# EAGLE design LEDSubMatrixLowDensityTHT (EAGLE 9.6.2)
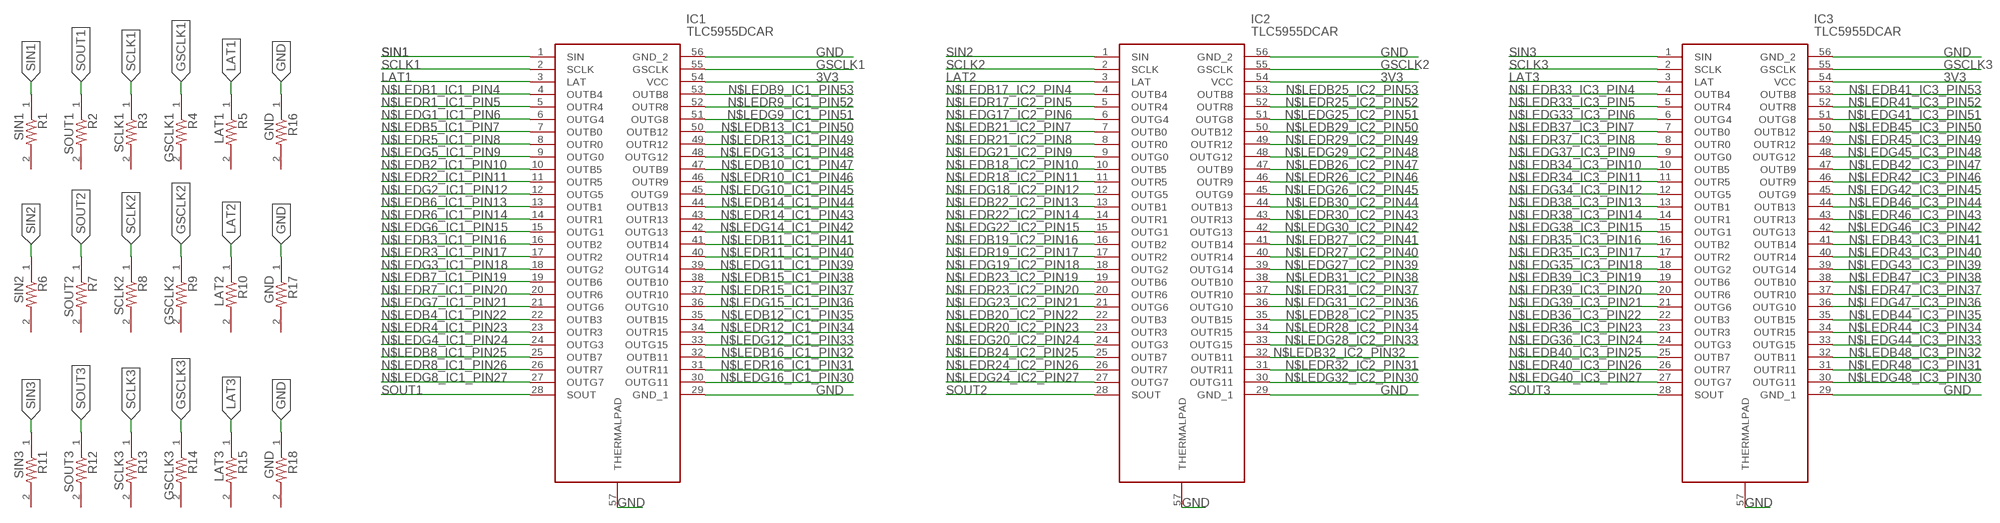
[diagram p0: schematic, sheet 1, part 1 of 2]
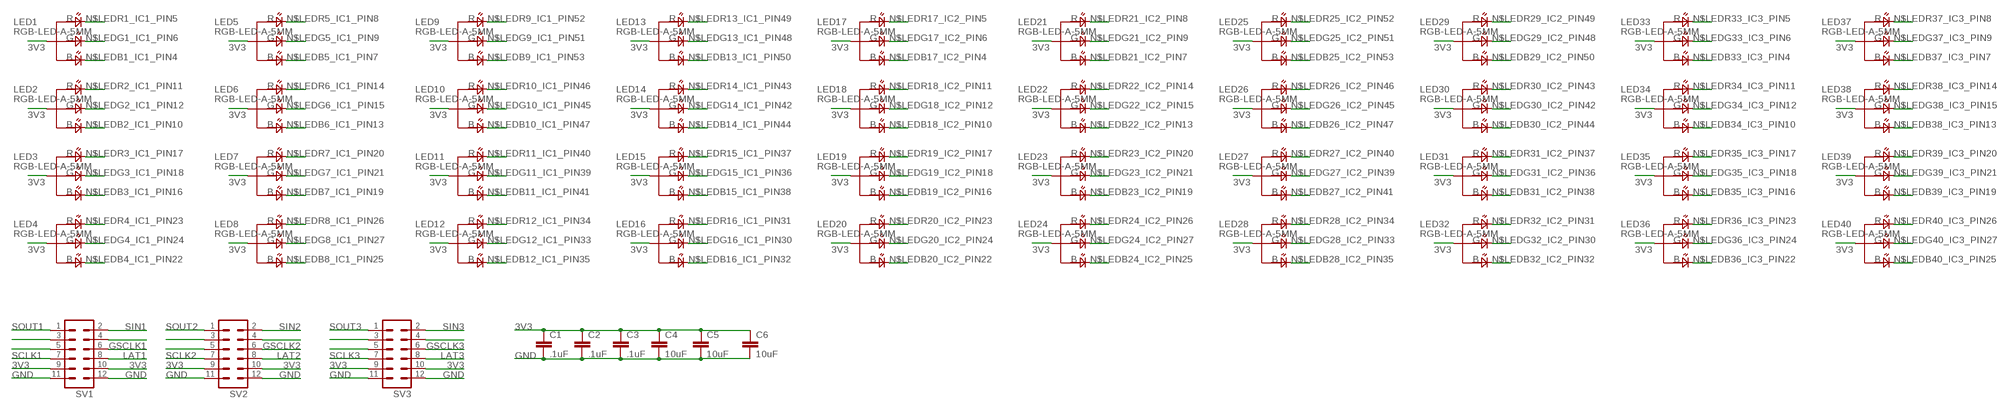
[diagram p1: schematic, sheet 1, part 2 of 2]

## Parts
C1  .1uF  C-EUC0603  [C0603]
C2  .1uF  C-EUC0603  [C0603]
C3  .1uF  C-EUC0603  [C0603]
C4  10uF  C-EUC0805  [C0805]
C5  10uF  C-EUC0805  [C0805]
C6  10uF  C-EUC0805  [C0805]
IC1  TLC5955DCAR  [SOP50P810X120-57N]
IC2  TLC5955DCAR  [SOP50P810X120-57N]
IC3  TLC5955DCAR  [SOP50P810X120-57N]
LED1  RGB-LED-A-5MM  [RGBLED-A-5MM]
LED2  RGB-LED-A-5MM  [RGBLED-A-5MM]
LED3  RGB-LED-A-5MM  [RGBLED-A-5MM]
LED4  RGB-LED-A-5MM  [RGBLED-A-5MM]
LED5  RGB-LED-A-5MM  [RGBLED-A-5MM]
LED6  RGB-LED-A-5MM  [RGBLED-A-5MM]
LED7  RGB-LED-A-5MM  [RGBLED-A-5MM]
LED8  RGB-LED-A-5MM  [RGBLED-A-5MM]
LED9  RGB-LED-A-5MM  [RGBLED-A-5MM]
LED10  RGB-LED-A-5MM  [RGBLED-A-5MM]
LED11  RGB-LED-A-5MM  [RGBLED-A-5MM]
LED12  RGB-LED-A-5MM  [RGBLED-A-5MM]
LED13  RGB-LED-A-5MM  [RGBLED-A-5MM]
LED14  RGB-LED-A-5MM  [RGBLED-A-5MM]
LED15  RGB-LED-A-5MM  [RGBLED-A-5MM]
LED16  RGB-LED-A-5MM  [RGBLED-A-5MM]
LED17  RGB-LED-A-5MM  [RGBLED-A-5MM]
LED18  RGB-LED-A-5MM  [RGBLED-A-5MM]
LED19  RGB-LED-A-5MM  [RGBLED-A-5MM]
LED20  RGB-LED-A-5MM  [RGBLED-A-5MM]
LED21  RGB-LED-A-5MM  [RGBLED-A-5MM]
LED22  RGB-LED-A-5MM  [RGBLED-A-5MM]
LED23  RGB-LED-A-5MM  [RGBLED-A-5MM]
LED24  RGB-LED-A-5MM  [RGBLED-A-5MM]
LED25  RGB-LED-A-5MM  [RGBLED-A-5MM]
LED26  RGB-LED-A-5MM  [RGBLED-A-5MM]
LED27  RGB-LED-A-5MM  [RGBLED-A-5MM]
LED28  RGB-LED-A-5MM  [RGBLED-A-5MM]
LED29  RGB-LED-A-5MM  [RGBLED-A-5MM]
LED30  RGB-LED-A-5MM  [RGBLED-A-5MM]
LED31  RGB-LED-A-5MM  [RGBLED-A-5MM]
LED32  RGB-LED-A-5MM  [RGBLED-A-5MM]
LED33  RGB-LED-A-5MM  [RGBLED-A-5MM]
LED34  RGB-LED-A-5MM  [RGBLED-A-5MM]
LED35  RGB-LED-A-5MM  [RGBLED-A-5MM]
LED36  RGB-LED-A-5MM  [RGBLED-A-5MM]
LED37  RGB-LED-A-5MM  [RGBLED-A-5MM]
LED38  RGB-LED-A-5MM  [RGBLED-A-5MM]
LED39  RGB-LED-A-5MM  [RGBLED-A-5MM]
LED40  RGB-LED-A-5MM  [RGBLED-A-5MM]
R1  SIN1  RCWCTE  [RESC3216X70N]
R2  SOUT1  RCWCTE  [RESC3216X70N]
R3  SCLK1  RCWCTE  [RESC3216X70N]
R4  GSCLK1  RCWCTE  [RESC3216X70N]
R5  LAT1  RCWCTE  [RESC3216X70N]
R6  SIN2  RCWCTE  [RESC3216X70N]
R7  SOUT2  RCWCTE  [RESC3216X70N]
R8  SCLK2  RCWCTE  [RESC3216X70N]
R9  GSCLK2  RCWCTE  [RESC3216X70N]
R10  LAT2  RCWCTE  [RESC3216X70N]
R11  SIN3  RCWCTE  [RESC3216X70N]
R12  SOUT3  RCWCTE  [RESC3216X70N]
R13  SCLK3  RCWCTE  [RESC3216X70N]
R14  GSCLK3  RCWCTE  [RESC3216X70N]
R15  LAT3  RCWCTE  [RESC3216X70N]
R16  GND  RCWCTE  [RESC3216X70N]
R17  GND  RCWCTE  [RESC3216X70N]
R18  GND  RCWCTE  [RESC3216X70N]
SV1  MA06-2  [MA06-2]
SV2  MA06-2  [MA06-2]
SV3  MA06-2  [MA06-2]

## Nets
3V3: C1.1 C2.1 C3.1 C4.1 C5.1 C6.1 IC1.54(VCC) IC2.54(VCC) IC3.54(VCC) LED1.AN(COM) LED2.AN(COM) LED3.AN(COM) LED4.AN(COM) LED5.AN(COM) LED6.AN(COM) LED7.AN(COM) LED8.AN(COM) LED9.AN(COM) LED10.AN(COM) LED11.AN(COM) LED12.AN(COM) LED13.AN(COM) LED14.AN(COM) LED15.AN(COM) LED16.AN(COM) LED17.AN(COM) LED18.AN(COM) LED19.AN(COM) LED20.AN(COM) LED21.AN(COM) LED22.AN(COM) LED23.AN(COM) LED24.AN(COM) LED25.AN(COM) LED26.AN(COM) LED27.AN(COM) LED28.AN(COM) LED29.AN(COM) LED30.AN(COM) LED31.AN(COM) LED32.AN(COM) LED33.AN(COM) LED34.AN(COM) LED35.AN(COM) LED36.AN(COM) LED37.AN(COM) LED38.AN(COM) LED39.AN(COM) LED40.AN(COM) SV1.9 SV1.10 SV2.9 SV2.10 SV3.9 SV3.10
GND: C1.2 C2.2 C3.2 C4.2 C5.2 C6.2 IC1.29(GND_1) IC1.56(GND_2) IC1.57(THERMALPAD) IC2.29(GND_1) IC2.56(GND_2) IC2.57(THERMALPAD) IC3.29(GND_1) IC3.56(GND_2) IC3.57(THERMALPAD) R16.1 R17.1 R18.1 SV1.11 SV1.12 SV2.11 SV2.12 SV3.11 SV3.12
GSCLK1: IC1.55(GSCLK) R4.1 SV1.6
GSCLK2: IC2.55(GSCLK) R9.1 SV2.6
GSCLK3: IC3.55(GSCLK) R14.1 SV3.6
LAT1: IC1.3(LAT) R5.1 SV1.8
LAT2: IC2.3(LAT) R10.1 SV2.8
LAT3: IC3.3(LAT) R15.1 SV3.8
N$2: SV1.3
N$3: SV1.5
N$5: SV1.4
N$7: SV2.3
N$8: SV2.5
N$10: SV2.4
N$12: SV3.3
N$13: SV3.5
N$15: SV3.4
N$LEDB1_IC1_PIN4: IC1.4(OUTB4) LED1.B(BLUE)
N$LEDB2_IC1_PIN10: IC1.10(OUTB5) LED2.B(BLUE)
N$LEDB3_IC1_PIN16: IC1.16(OUTB2) LED3.B(BLUE)
N$LEDB4_IC1_PIN22: IC1.22(OUTB3) LED4.B(BLUE)
N$LEDB5_IC1_PIN7: IC1.7(OUTB0) LED5.B(BLUE)
N$LEDB6_IC1_PIN13: IC1.13(OUTB1) LED6.B(BLUE)
N$LEDB7_IC1_PIN19: IC1.19(OUTB6) LED7.B(BLUE)
N$LEDB8_IC1_PIN25: IC1.25(OUTB7) LED8.B(BLUE)
N$LEDB9_IC1_PIN53: IC1.53(OUTB8) LED9.B(BLUE)
N$LEDB10_IC1_PIN47: IC1.47(OUTB9) LED10.B(BLUE)
N$LEDB11_IC1_PIN41: IC1.41(OUTB14) LED11.B(BLUE)
N$LEDB12_IC1_PIN35: IC1.35(OUTB15) LED12.B(BLUE)
N$LEDB13_IC1_PIN50: IC1.50(OUTB12) LED13.B(BLUE)
N$LEDB14_IC1_PIN44: IC1.44(OUTB13) LED14.B(BLUE)
N$LEDB15_IC1_PIN38: IC1.38(OUTB10) LED15.B(BLUE)
N$LEDB16_IC1_PIN32: IC1.32(OUTB11) LED16.B(BLUE)
N$LEDB17_IC2_PIN4: IC2.4(OUTB4) LED17.B(BLUE)
N$LEDB18_IC2_PIN10: IC2.10(OUTB5) LED18.B(BLUE)
N$LEDB19_IC2_PIN16: IC2.16(OUTB2) LED19.B(BLUE)
N$LEDB20_IC2_PIN22: IC2.22(OUTB3) LED20.B(BLUE)
N$LEDB21_IC2_PIN7: IC2.7(OUTB0) LED21.B(BLUE)
N$LEDB22_IC2_PIN13: IC2.13(OUTB1) LED22.B(BLUE)
N$LEDB23_IC2_PIN19: IC2.19(OUTB6) LED23.B(BLUE)
N$LEDB24_IC2_PIN25: IC2.25(OUTB7) LED24.B(BLUE)
N$LEDB25_IC2_PIN53: IC2.53(OUTB8) LED25.B(BLUE)
N$LEDB26_IC2_PIN47: IC2.47(OUTB9) LED26.B(BLUE)
N$LEDB27_IC2_PIN41: IC2.41(OUTB14) LED27.B(BLUE)
N$LEDB28_IC2_PIN35: IC2.35(OUTB15) LED28.B(BLUE)
N$LEDB29_IC2_PIN50: IC2.50(OUTB12) LED29.B(BLUE)
N$LEDB30_IC2_PIN44: IC2.44(OUTB13) LED30.B(BLUE)
N$LEDB31_IC2_PIN38: IC2.38(OUTB10) LED31.B(BLUE)
N$LEDB32_IC2_PIN32: IC2.32(OUTB11) LED32.B(BLUE)
N$LEDB33_IC3_PIN4: IC3.4(OUTB4) LED33.B(BLUE)
N$LEDB34_IC3_PIN10: IC3.10(OUTB5) LED34.B(BLUE)
N$LEDB35_IC3_PIN16: IC3.16(OUTB2) LED35.B(BLUE)
N$LEDB36_IC3_PIN22: IC3.22(OUTB3) LED36.B(BLUE)
N$LEDB37_IC3_PIN7: IC3.7(OUTB0) LED37.B(BLUE)
N$LEDB38_IC3_PIN13: IC3.13(OUTB1) LED38.B(BLUE)
N$LEDB39_IC3_PIN19: IC3.19(OUTB6) LED39.B(BLUE)
N$LEDB40_IC3_PIN25: IC3.25(OUTB7) LED40.B(BLUE)
N$LEDB41_IC3_PIN53: IC3.53(OUTB8)
N$LEDB42_IC3_PIN47: IC3.47(OUTB9)
N$LEDB43_IC3_PIN41: IC3.41(OUTB14)
N$LEDB44_IC3_PIN35: IC3.35(OUTB15)
N$LEDB45_IC3_PIN50: IC3.50(OUTB12)
N$LEDB46_IC3_PIN44: IC3.44(OUTB13)
N$LEDB47_IC3_PIN38: IC3.38(OUTB10)
N$LEDB48_IC3_PIN32: IC3.32(OUTB11)
N$LEDG1_IC1_PIN6: IC1.6(OUTG4) LED1.G(GREEN)
N$LEDG2_IC1_PIN12: IC1.12(OUTG5) LED2.G(GREEN)
N$LEDG3_IC1_PIN18: IC1.18(OUTG2) LED3.G(GREEN)
N$LEDG4_IC1_PIN24: IC1.24(OUTG3) LED4.G(GREEN)
N$LEDG5_IC1_PIN9: IC1.9(OUTG0) LED5.G(GREEN)
N$LEDG6_IC1_PIN15: IC1.15(OUTG1) LED6.G(GREEN)
N$LEDG7_IC1_PIN21: IC1.21(OUTG6) LED7.G(GREEN)
N$LEDG8_IC1_PIN27: IC1.27(OUTG7) LED8.G(GREEN)
N$LEDG9_IC1_PIN51: IC1.51(OUTG8) LED9.G(GREEN)
N$LEDG10_IC1_PIN45: IC1.45(OUTG9) LED10.G(GREEN)
N$LEDG11_IC1_PIN39: IC1.39(OUTG14) LED11.G(GREEN)
N$LEDG12_IC1_PIN33: IC1.33(OUTG15) LED12.G(GREEN)
N$LEDG13_IC1_PIN48: IC1.48(OUTG12) LED13.G(GREEN)
N$LEDG14_IC1_PIN42: IC1.42(OUTG13) LED14.G(GREEN)
N$LEDG15_IC1_PIN36: IC1.36(OUTG10) LED15.G(GREEN)
N$LEDG16_IC1_PIN30: IC1.30(OUTG11) LED16.G(GREEN)
N$LEDG17_IC2_PIN6: IC2.6(OUTG4) LED17.G(GREEN)
N$LEDG18_IC2_PIN12: IC2.12(OUTG5) LED18.G(GREEN)
N$LEDG19_IC2_PIN18: IC2.18(OUTG2) LED19.G(GREEN)
N$LEDG20_IC2_PIN24: IC2.24(OUTG3) LED20.G(GREEN)
N$LEDG21_IC2_PIN9: IC2.9(OUTG0) LED21.G(GREEN)
N$LEDG22_IC2_PIN15: IC2.15(OUTG1) LED22.G(GREEN)
N$LEDG23_IC2_PIN21: IC2.21(OUTG6) LED23.G(GREEN)
N$LEDG24_IC2_PIN27: IC2.27(OUTG7) LED24.G(GREEN)
N$LEDG25_IC2_PIN51: IC2.51(OUTG8) LED25.G(GREEN)
N$LEDG26_IC2_PIN45: IC2.45(OUTG9) LED26.G(GREEN)
N$LEDG27_IC2_PIN39: IC2.39(OUTG14) LED27.G(GREEN)
N$LEDG28_IC2_PIN33: IC2.33(OUTG15) LED28.G(GREEN)
N$LEDG29_IC2_PIN48: IC2.48(OUTG12) LED29.G(GREEN)
N$LEDG30_IC2_PIN42: IC2.42(OUTG13) LED30.G(GREEN)
N$LEDG31_IC2_PIN36: IC2.36(OUTG10) LED31.G(GREEN)
N$LEDG32_IC2_PIN30: IC2.30(OUTG11) LED32.G(GREEN)
N$LEDG33_IC3_PIN6: IC3.6(OUTG4) LED33.G(GREEN)
N$LEDG34_IC3_PIN12: IC3.12(OUTG5) LED34.G(GREEN)
N$LEDG35_IC3_PIN18: IC3.18(OUTG2) LED35.G(GREEN)
N$LEDG36_IC3_PIN24: IC3.24(OUTG3) LED36.G(GREEN)
N$LEDG37_IC3_PIN9: IC3.9(OUTG0) LED37.G(GREEN)
N$LEDG38_IC3_PIN15: IC3.15(OUTG1) LED38.G(GREEN)
N$LEDG39_IC3_PIN21: IC3.21(OUTG6) LED39.G(GREEN)
N$LEDG40_IC3_PIN27: IC3.27(OUTG7) LED40.G(GREEN)
N$LEDG41_IC3_PIN51: IC3.51(OUTG8)
N$LEDG42_IC3_PIN45: IC3.45(OUTG9)
N$LEDG43_IC3_PIN39: IC3.39(OUTG14)
N$LEDG44_IC3_PIN33: IC3.33(OUTG15)
N$LEDG45_IC3_PIN48: IC3.48(OUTG12)
N$LEDG46_IC3_PIN42: IC3.42(OUTG13)
N$LEDG47_IC3_PIN36: IC3.36(OUTG10)
N$LEDG48_IC3_PIN30: IC3.30(OUTG11)
N$LEDR1_IC1_PIN5: IC1.5(OUTR4) LED1.R(RED)
N$LEDR2_IC1_PIN11: IC1.11(OUTR5) LED2.R(RED)
N$LEDR3_IC1_PIN17: IC1.17(OUTR2) LED3.R(RED)
N$LEDR4_IC1_PIN23: IC1.23(OUTR3) LED4.R(RED)
N$LEDR5_IC1_PIN8: IC1.8(OUTR0) LED5.R(RED)
N$LEDR6_IC1_PIN14: IC1.14(OUTR1) LED6.R(RED)
N$LEDR7_IC1_PIN20: IC1.20(OUTR6) LED7.R(RED)
N$LEDR8_IC1_PIN26: IC1.26(OUTR7) LED8.R(RED)
N$LEDR9_IC1_PIN52: IC1.52(OUTR8) LED9.R(RED)
N$LEDR10_IC1_PIN46: IC1.46(OUTR9) LED10.R(RED)
N$LEDR11_IC1_PIN40: IC1.40(OUTR14) LED11.R(RED)
N$LEDR12_IC1_PIN34: IC1.34(OUTR15) LED12.R(RED)
N$LEDR13_IC1_PIN49: IC1.49(OUTR12) LED13.R(RED)
N$LEDR14_IC1_PIN43: IC1.43(OUTR13) LED14.R(RED)
N$LEDR15_IC1_PIN37: IC1.37(OUTR10) LED15.R(RED)
N$LEDR16_IC1_PIN31: IC1.31(OUTR11) LED16.R(RED)
N$LEDR17_IC2_PIN5: IC2.5(OUTR4) LED17.R(RED)
N$LEDR18_IC2_PIN11: IC2.11(OUTR5) LED18.R(RED)
N$LEDR19_IC2_PIN17: IC2.17(OUTR2) LED19.R(RED)
N$LEDR20_IC2_PIN23: IC2.23(OUTR3) LED20.R(RED)
N$LEDR21_IC2_PIN8: IC2.8(OUTR0) LED21.R(RED)
N$LEDR22_IC2_PIN14: IC2.14(OUTR1) LED22.R(RED)
N$LEDR23_IC2_PIN20: IC2.20(OUTR6) LED23.R(RED)
N$LEDR24_IC2_PIN26: IC2.26(OUTR7) LED24.R(RED)
N$LEDR25_IC2_PIN52: IC2.52(OUTR8) LED25.R(RED)
N$LEDR26_IC2_PIN46: IC2.46(OUTR9) LED26.R(RED)
N$LEDR27_IC2_PIN40: IC2.40(OUTR14) LED27.R(RED)
N$LEDR28_IC2_PIN34: IC2.34(OUTR15) LED28.R(RED)
N$LEDR29_IC2_PIN49: IC2.49(OUTR12) LED29.R(RED)
N$LEDR30_IC2_PIN43: IC2.43(OUTR13) LED30.R(RED)
N$LEDR31_IC2_PIN37: IC2.37(OUTR10) LED31.R(RED)
N$LEDR32_IC2_PIN31: IC2.31(OUTR11) LED32.R(RED)
N$LEDR33_IC3_PIN5: IC3.5(OUTR4) LED33.R(RED)
N$LEDR34_IC3_PIN11: IC3.11(OUTR5) LED34.R(RED)
N$LEDR35_IC3_PIN17: IC3.17(OUTR2) LED35.R(RED)
N$LEDR36_IC3_PIN23: IC3.23(OUTR3) LED36.R(RED)
N$LEDR37_IC3_PIN8: IC3.8(OUTR0) LED37.R(RED)
N$LEDR38_IC3_PIN14: IC3.14(OUTR1) LED38.R(RED)
N$LEDR39_IC3_PIN20: IC3.20(OUTR6) LED39.R(RED)
N$LEDR40_IC3_PIN26: IC3.26(OUTR7) LED40.R(RED)
N$LEDR41_IC3_PIN52: IC3.52(OUTR8)
N$LEDR42_IC3_PIN46: IC3.46(OUTR9)
N$LEDR43_IC3_PIN40: IC3.40(OUTR14)
N$LEDR44_IC3_PIN34: IC3.34(OUTR15)
N$LEDR45_IC3_PIN49: IC3.49(OUTR12)
N$LEDR46_IC3_PIN43: IC3.43(OUTR13)
N$LEDR47_IC3_PIN37: IC3.37(OUTR10)
N$LEDR48_IC3_PIN31: IC3.31(OUTR11)
SCLK1: IC1.2(SCLK) R3.1 SV1.7
SCLK2: IC2.2(SCLK) R8.1 SV2.7
SCLK3: IC3.2(SCLK) R13.1 SV3.7
SIN1: IC1.1(SIN) R1.1 SV1.2
SIN2: IC2.1(SIN) R6.1 SV2.2
SIN3: IC3.1(SIN) R11.1 SV3.2
SOUT1: IC1.28(SOUT) R2.1 SV1.1
SOUT2: IC2.28(SOUT) R7.1 SV2.1
SOUT3: IC3.28(SOUT) R12.1 SV3.1
Unconnected: R1.2 R2.2 R3.2 R4.2 R5.2 R6.2 R7.2 R8.2 R9.2 R10.2 R11.2 R12.2 R13.2 R14.2 R15.2 R16.2 R17.2 R18.2

## Library data of the parts
C1-C6 = rcl:C-EU: CAPACITOR, European symbol; SPICEPREFIX: C
IC1-IC3 = TLC5955DCAR:TLC5955DCAR: 48ch, 16bit PWM LED Driver with Dot-Correction, Brightness Control, Open/Short Detection Source: Datasheet <http://www.ti.com/lit/ds/symlink/tlc5955.pdf>; ARROW_PART_NUMBER: TLC5955DCAR; ARROW_PRICE-STOCK: https://www.arrow.com/en/products/tlc5955dcar/texas-instruments; DESCRIPTION: 48ch, 16bit PWM LED Driver with Dot-Correction, Brightness Control, Open/Short Detection; HEIGHT: 1.2mm; MANUFACTURER_NAME: Texas Instruments; MANUFACTURER_PART_NUMBER: TLC5955DCAR; MOUSER_PART_NUMBER: 595-TLC5955DCAR; MOUSER_PRICE-STOCK: https://www.mouser.co.uk/ProductDetail/Texas-Instruments/TLC5955DCAR?qs=%2Fd%252BFzHvH4c3zo%2FeGYG5n7g%3D%3D
LED1-LED40 = VoxelEagleLib:RGB-LED-A-5MM
R1-R18 = RCWCTE:RCWCTE: Res 1206 0 Ohm Metal SMD Automotive Embossed Plastic T/R; DESCRIPTION: - PC Test Point - - Plating Surface Mount Mounting Type; DIGI-KEY_PART_NUMBER: 2019-RCWCTECT-ND; MF: KOA Speer; MP: RCWCTE; PACKAGE: None; PURCHASE-URL: https://pricing.snapeda.com/search/part/RCWCTE/?ref=eda
SV1-SV3 = con-lstb:MA06-2: PIN HEADER; OC_FARNELL: unknown; OC_NEWARK: unknown

## Board
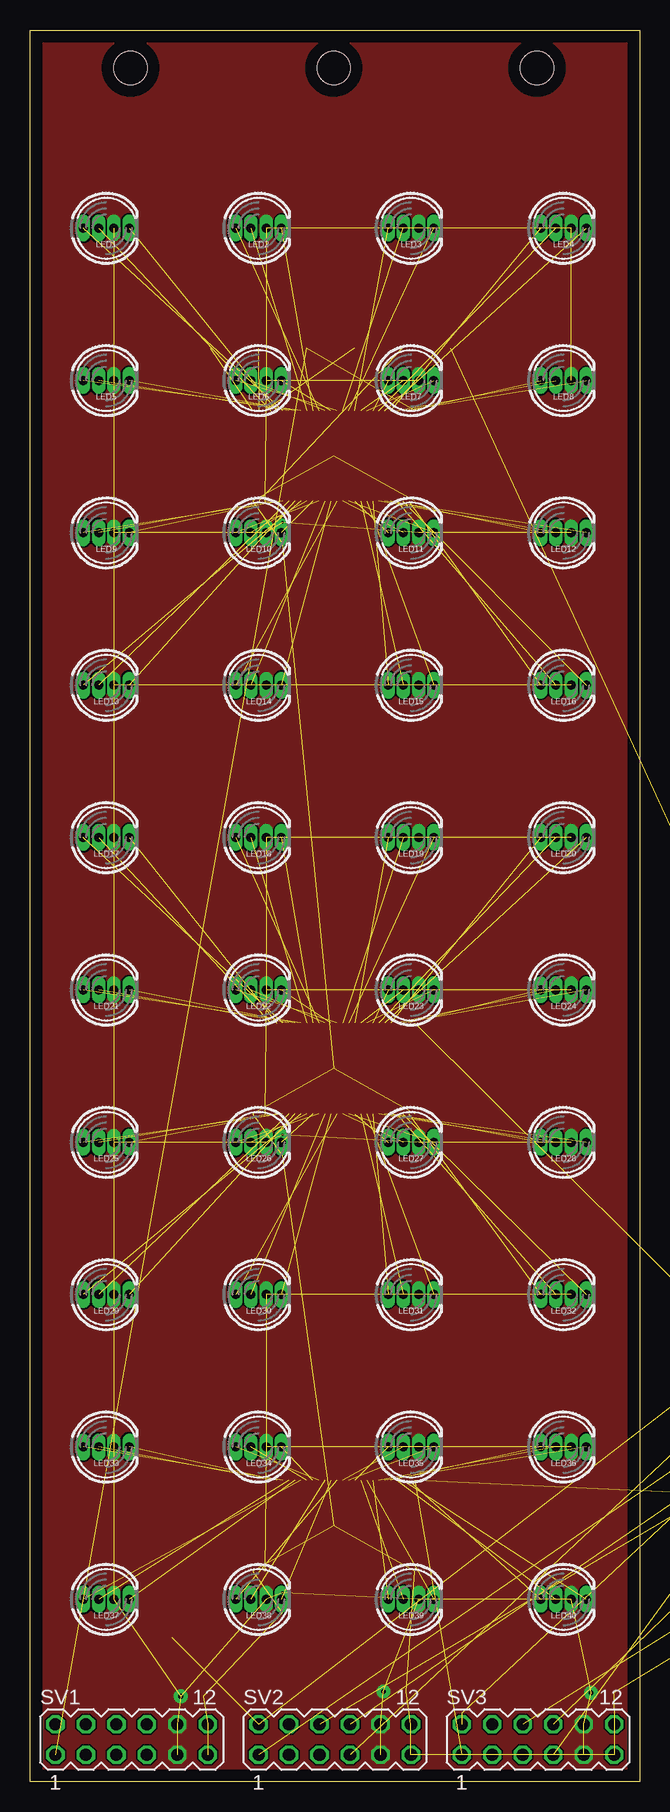
[diagram p2: board, top side]
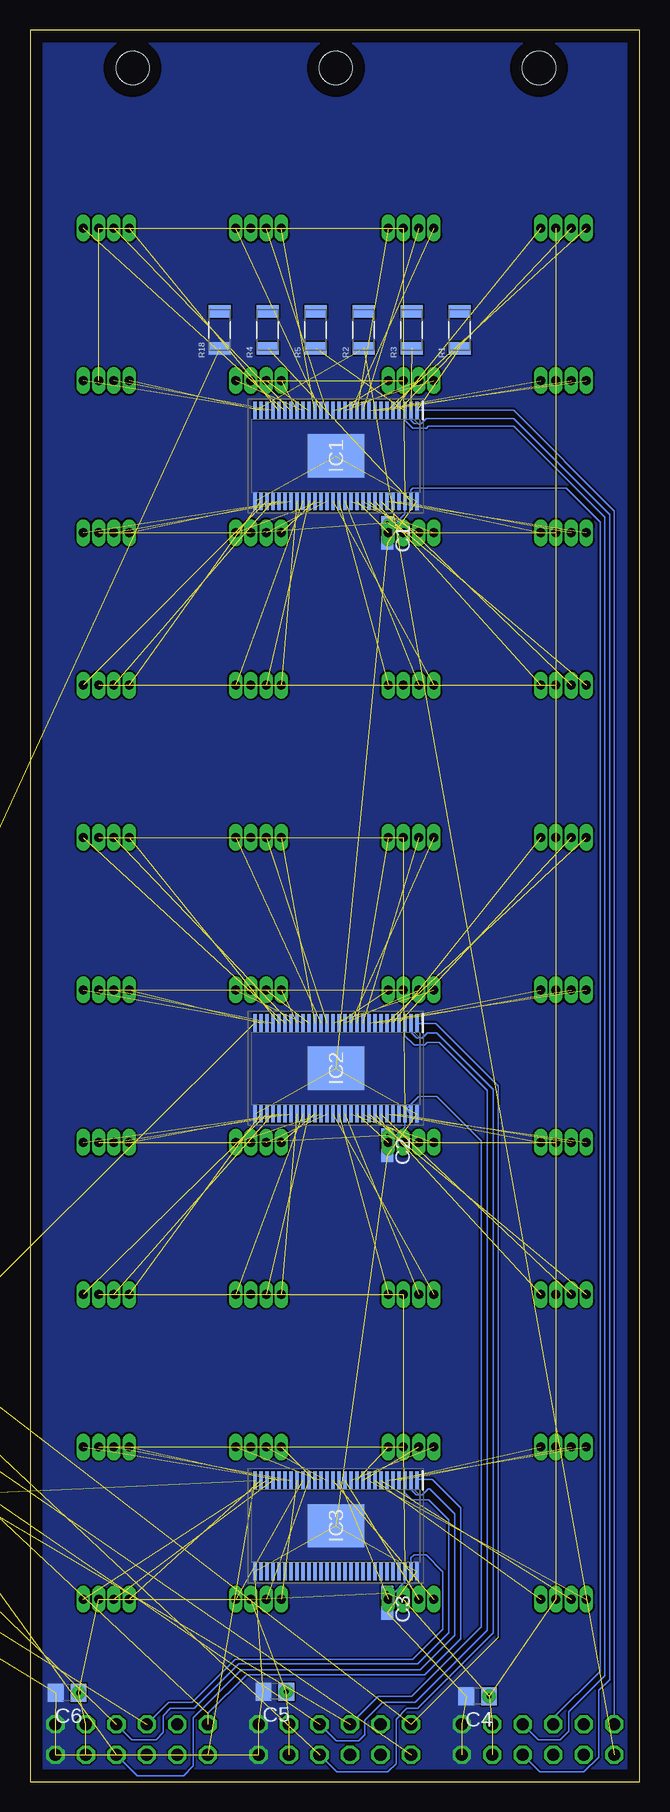
[diagram p3: board, bottom side, seen from below]

Size 50.8 x 146 mm. Coordinates in mm from the lower left corner, seen from the top.
Outline: 0,146 50.8,146 50.8,0 0,0 0,146
Copper layers (1*16): Top 0.035mm / dielectric 1.5mm / Bottom 0.035mm
Design rules "default *": minimum track width 6mil, minimum drill 0.35mm, track to track 6mil, track to pad 6mil, pad to pad 6mil, via to via 6mil, smd to smd 6mil, copper to edge 40mil, drill to drill 6mil, minimum pad ring 0.000253125mm, minimum via ring 8mil, stop-mask expansion 4mil, vias tented up to drill 0mil, thermal gap 10mil
Holes 2.75 mm at 8.38,142.82 25.32,142.82 42.25,142.82

### Footprints (pad centres in the part's own frame; a part is rotated, then mirrored left to right if it is on the bottom)
C0603 = smd 1.1 x 1: 1 -0.85,0; 2 0.85,0
C0805 = smd 1.3 x 1.5: 1 -0.95,0; 2 0.95,0
SOP50P810X120-57N = smd 1.475 x 0.3: 1 -3.788,6.75; 2 -3.788,6.25; 3 -3.788,5.75; 4 -3.788,5.25; 5 -3.788,4.75; 6 -3.788,4.25; 7 -3.788,3.75; 8 -3.788,3.25; 9 -3.788,2.75; 10 -3.788,2.25; 11 -3.788,1.75; 12 -3.788,1.25; 13 -3.788,0.75; 14 -3.788,0.25; 15 -3.788,-0.25; 16 -3.788,-0.75; 17 -3.788,-1.25; 18 -3.788,-1.75; 19 -3.788,-2.25; 20 -3.788,-2.75; 21 -3.788,-3.25; 22 -3.788,-3.75; 23 -3.788,-4.25; 24 -3.788,-4.75; 25 -3.788,-5.25; 26 -3.788,-5.75; 27 -3.788,-6.25; 28 -3.788,-6.75; 29 3.788,-6.75; 30 3.788,-6.25; 31 3.788,-5.75; 32 3.788,-5.25; 33 3.788,-4.75; 34 3.788,-4.25; 35 3.788,-3.75; 36 3.788,-3.25; 37 3.788,-2.75; 38 3.788,-2.25; 39 3.788,-1.75; 40 3.788,-1.25; 41 3.788,-0.75; 42 3.788,-0.25; 43 3.788,0.25; 44 3.788,0.75; 45 3.788,1.25; 46 3.788,1.75; 47 3.788,2.25; 48 3.788,2.75; 49 3.788,3.25; 50 3.788,3.75; 51 3.788,4.25; 52 3.788,4.75; 53 3.788,5.25; 54 3.788,5.75; 55 3.788,6.25; 56 3.788,6.75 | smd 3.61 x 4.7: 57 0,0
RGBLED-A-5MM = drill 0.75 pad 0.813 long: AN 0.635,0; B -0.635,0; G -1.905,0; R 1.905,0
RESC3216X70N = smd 1.04 x 1.82: 1 -1.54,0; 2 1.54,0
MA06-2 = drill 1.016 octagon: 1 -6.35,-1.27; 2 -6.35,1.27; 3 -3.81,-1.27; 4 -3.81,1.27; 5 -1.27,-1.27; 6 -1.27,1.27; 7 1.27,-1.27; 8 1.27,1.27; 9 3.81,-1.27; 10 3.81,1.27; 11 6.35,-1.27; 12 6.35,1.27

### Placement (x,y rotation side)
C1  21.03,104.1 270 bottom
C2  21.03,53.05 270 bottom
C3  21.03,14.9 270 bottom
C4  13.5,7.1 180 bottom
C5  30.4,7.5 180 bottom
C6  47.7,7.4 180 bottom
IC1  25.32,110.5 270 bottom
IC2  25.32,59.45 270 bottom
IC3  25.32,21.32 270 bottom
LED1  6.35,129.49 0 top
LED2  19.05,129.49 0 top
LED3  31.75,129.49 0 top
LED4  44.45,129.49 0 top
LED5  6.35,116.79 0 top
LED6  19.05,116.79 0 top
LED7  31.75,116.79 0 top
LED8  44.45,116.79 0 top
LED9  6.35,104.09 0 top
LED10  19.05,104.09 0 top
LED11  31.75,104.09 0 top
LED12  44.45,104.09 0 top
LED13  6.35,91.39 0 top
LED14  19.05,91.39 0 top
LED15  31.75,91.39 0 top
LED16  44.45,91.39 0 top
LED17  6.35,78.69 0 top
LED18  19.05,78.69 0 top
LED19  31.75,78.69 0 top
LED20  44.45,78.69 0 top
LED21  6.35,65.99 0 top
LED22  19.05,65.99 0 top
LED23  31.75,65.99 0 top
LED24  44.45,65.99 0 top
LED25  6.35,53.29 0 top
LED26  19.05,53.29 0 top
LED27  31.75,53.29 0 top
LED28  44.45,53.29 0 top
LED29  6.35,40.59 0 top
LED30  19.05,40.59 0 top
LED31  31.75,40.59 0 top
LED32  44.45,40.59 0 top
LED33  6.35,27.89 0 top
LED34  19.05,27.89 0 top
LED35  31.75,27.89 0 top
LED36  44.45,27.89 0 top
LED37  6.35,15.19 0 top
LED38  19.05,15.19 0 top
LED39  31.75,15.19 0 top
LED40  44.45,15.19 0 top
R1  15,121 90 bottom
R2  23,121 90 bottom
R3  19,121 90 bottom
R4  31,121 90 bottom
R5  27,121 90 bottom
R6  55,34 90 bottom  (outside the outline)
R7  63,34 90 bottom  (outside the outline)
R8  59,34 90 bottom  (outside the outline)
R9  71,34 90 bottom  (outside the outline)
R10  67,34 90 bottom  (outside the outline)
R11  55,25 90 bottom  (outside the outline)
R12  67,25 90 bottom  (outside the outline)
R13  59,25 90 bottom  (outside the outline)
R14  71,25 90 bottom  (outside the outline)
R15  63,25 90 bottom  (outside the outline)
R16  75,34 90 bottom  (outside the outline)
R17  75,25 90 bottom  (outside the outline)
R18  35,121 90 bottom
SV1  8.47,3.5 0 top
SV2  25.4,3.5 0 top
SV3  42.33,3.5 0 top

### Tracks (layer width: path | path; a pad name or v marks a point on that pad's centre or on a via)
3V3  (via drill 0.2, 0.4 pad 1.15)  (51 unrouted)
  Bottom 0.127: IC1.54 19.57,105.63 20.25,104.95 C1.1 | IC2.54 19.57,54.53 20.2,53.9 C2.1 | IC3.54 19.57,16.63 20.45,15.75 C3.1
  other vias: 21.03,104.95 21.03,53.9 21.03,15.75 12.55,7.1 29.45,7.5 46.75,7.4
  pour Top (no thermals): -20,166 82,166 82,-6 -20,-6
GND  (23 unrouted)
  pour Bottom (no thermals): -20,166 76.2,166 76.2,-3 -20,-3
GSCLK1  (1 unrouted)
  Bottom 0.127: SV1.6 7.2,5.3 3.3,9.2 3.3,105 6.1,107.8 18.9,107.8 19.07,107.63 IC1.55
GSCLK2  (1 unrouted)
  Bottom 0.127: SV2.6 21.8,7.1 19,7.1 13.2,12.9 13.2,53.4 16.9,57.1 18.39,57.1 19.45,56.04 IC2.55
GSCLK3  (1 unrouted)
  Bottom 0.127: SV3.6 39.23,6.6 37.3,6.6 33.7,10.2 18.9,10.2 16.4,12.7 16.4,17.5 17.8,18.9 18.8,18.9 19.07,18.64 IC3.55
LAT1  (1 unrouted)
  Bottom 0.127: SV1.8 8.47,3.5 6.6,3.5 5.9,4.2 5.9,5.8 2.9,8.8 2.9,105.4 10.48,112.98 17.6,112.98 17.8,112.78 17.82,112.8 18.9,112.8 19.57,113.47 IC1.3
LAT2  (1 unrouted)
  Bottom 0.127: SV2.8 25.3,3.4 23.4,3.4 22.9,3.9 22.9,5.1 21.4,6.6 18.7,6.6 12.7,12.6 12.7,57.6 16.7,61.6 17.7,61.6 17.9,61.4 18.8,61.4 19.57,62.17 IC2.3
LAT3  (1 unrouted)
  Bottom 0.127: SV3.8 42.33,3.5 40.3,3.5 39.7,4.1 39.7,5.5 39.1,6.1 37.1,6.1 33.4,9.8 18.5,9.8 15.9,12.4 15.9,21.8 17.58,23.48 18.98,23.48 19.57,24.06 IC3.3
N$LEDB1_IC1_PIN4  (1 unrouted)
N$LEDB2_IC1_PIN10  (1 unrouted)
N$LEDB3_IC1_PIN16  (1 unrouted)
N$LEDB4_IC1_PIN22  (1 unrouted)
N$LEDB5_IC1_PIN7  (1 unrouted)
N$LEDB6_IC1_PIN13  (1 unrouted)
N$LEDB7_IC1_PIN19  (1 unrouted)
N$LEDB8_IC1_PIN25  (1 unrouted)
N$LEDB9_IC1_PIN53  (1 unrouted)
N$LEDB10_IC1_PIN47  (1 unrouted)
N$LEDB11_IC1_PIN41  (1 unrouted)
N$LEDB12_IC1_PIN35  (1 unrouted)
N$LEDB13_IC1_PIN50  (1 unrouted)
N$LEDB14_IC1_PIN44  (1 unrouted)
N$LEDB15_IC1_PIN38  (1 unrouted)
N$LEDB16_IC1_PIN32  (1 unrouted)
N$LEDB17_IC2_PIN4  (1 unrouted)
N$LEDB18_IC2_PIN10  (1 unrouted)
N$LEDB19_IC2_PIN16  (1 unrouted)
N$LEDB20_IC2_PIN22  (1 unrouted)
N$LEDB21_IC2_PIN7  (1 unrouted)
N$LEDB22_IC2_PIN13  (1 unrouted)
N$LEDB23_IC2_PIN19  (1 unrouted)
N$LEDB24_IC2_PIN25  (1 unrouted)
N$LEDB25_IC2_PIN53  (1 unrouted)
N$LEDB26_IC2_PIN47  (1 unrouted)
N$LEDB27_IC2_PIN41  (1 unrouted)
N$LEDB28_IC2_PIN35  (1 unrouted)
N$LEDB29_IC2_PIN50  (1 unrouted)
N$LEDB30_IC2_PIN44  (1 unrouted)
N$LEDB31_IC2_PIN38  (1 unrouted)
N$LEDB32_IC2_PIN32  (1 unrouted)
N$LEDB33_IC3_PIN4  (1 unrouted)
N$LEDB34_IC3_PIN10  (1 unrouted)
N$LEDB35_IC3_PIN16  (1 unrouted)
N$LEDB36_IC3_PIN22  (1 unrouted)
N$LEDB37_IC3_PIN7  (1 unrouted)
N$LEDB38_IC3_PIN13  (1 unrouted)
N$LEDB39_IC3_PIN19  (1 unrouted)
N$LEDB40_IC3_PIN25  (1 unrouted)
N$LEDG1_IC1_PIN6  (1 unrouted)
N$LEDG2_IC1_PIN12  (1 unrouted)
N$LEDG3_IC1_PIN18  (1 unrouted)
N$LEDG4_IC1_PIN24  (1 unrouted)
N$LEDG5_IC1_PIN9  (1 unrouted)
N$LEDG6_IC1_PIN15  (1 unrouted)
N$LEDG7_IC1_PIN21  (1 unrouted)
N$LEDG8_IC1_PIN27  (1 unrouted)
N$LEDG9_IC1_PIN51  (1 unrouted)
N$LEDG10_IC1_PIN45  (1 unrouted)
N$LEDG11_IC1_PIN39  (1 unrouted)
N$LEDG12_IC1_PIN33  (1 unrouted)
N$LEDG13_IC1_PIN48  (1 unrouted)
N$LEDG14_IC1_PIN42  (1 unrouted)
N$LEDG15_IC1_PIN36  (1 unrouted)
N$LEDG16_IC1_PIN30  (1 unrouted)
N$LEDG17_IC2_PIN6  (1 unrouted)
N$LEDG18_IC2_PIN12  (1 unrouted)
N$LEDG19_IC2_PIN18  (1 unrouted)
N$LEDG20_IC2_PIN24  (1 unrouted)
N$LEDG21_IC2_PIN9  (1 unrouted)
N$LEDG22_IC2_PIN15  (1 unrouted)
N$LEDG23_IC2_PIN21  (1 unrouted)
N$LEDG24_IC2_PIN27  (1 unrouted)
N$LEDG25_IC2_PIN51  (1 unrouted)
N$LEDG26_IC2_PIN45  (1 unrouted)
N$LEDG27_IC2_PIN39  (1 unrouted)
N$LEDG28_IC2_PIN33  (1 unrouted)
N$LEDG29_IC2_PIN48  (1 unrouted)
N$LEDG30_IC2_PIN42  (1 unrouted)
N$LEDG31_IC2_PIN36  (1 unrouted)
N$LEDG32_IC2_PIN30  (1 unrouted)
N$LEDG33_IC3_PIN6  (1 unrouted)
N$LEDG34_IC3_PIN12  (1 unrouted)
N$LEDG35_IC3_PIN18  (1 unrouted)
N$LEDG36_IC3_PIN24  (1 unrouted)
N$LEDG37_IC3_PIN9  (1 unrouted)
N$LEDG38_IC3_PIN15  (1 unrouted)
N$LEDG39_IC3_PIN21  (1 unrouted)
N$LEDG40_IC3_PIN27  (1 unrouted)
N$LEDR1_IC1_PIN5  (1 unrouted)
N$LEDR2_IC1_PIN11  (1 unrouted)
N$LEDR3_IC1_PIN17  (1 unrouted)
N$LEDR4_IC1_PIN23  (1 unrouted)
N$LEDR5_IC1_PIN8  (1 unrouted)
N$LEDR6_IC1_PIN14  (1 unrouted)
N$LEDR7_IC1_PIN20  (1 unrouted)
N$LEDR8_IC1_PIN26  (1 unrouted)
N$LEDR9_IC1_PIN52  (1 unrouted)
N$LEDR10_IC1_PIN46  (1 unrouted)
N$LEDR11_IC1_PIN40  (1 unrouted)
N$LEDR12_IC1_PIN34  (1 unrouted)
N$LEDR13_IC1_PIN49  (1 unrouted)
N$LEDR14_IC1_PIN43  (1 unrouted)
N$LEDR15_IC1_PIN37  (1 unrouted)
N$LEDR16_IC1_PIN31  (1 unrouted)
N$LEDR17_IC2_PIN5  (1 unrouted)
N$LEDR18_IC2_PIN11  (1 unrouted)
N$LEDR19_IC2_PIN17  (1 unrouted)
N$LEDR20_IC2_PIN23  (1 unrouted)
N$LEDR21_IC2_PIN8  (1 unrouted)
N$LEDR22_IC2_PIN14  (1 unrouted)
N$LEDR23_IC2_PIN20  (1 unrouted)
N$LEDR24_IC2_PIN26  (1 unrouted)
N$LEDR25_IC2_PIN52  (1 unrouted)
N$LEDR26_IC2_PIN46  (1 unrouted)
N$LEDR27_IC2_PIN40  (1 unrouted)
N$LEDR28_IC2_PIN34  (1 unrouted)
N$LEDR29_IC2_PIN49  (1 unrouted)
N$LEDR30_IC2_PIN43  (1 unrouted)
N$LEDR31_IC2_PIN37  (1 unrouted)
N$LEDR32_IC2_PIN31  (1 unrouted)
N$LEDR33_IC3_PIN5  (1 unrouted)
N$LEDR34_IC3_PIN11  (1 unrouted)
N$LEDR35_IC3_PIN17  (1 unrouted)
N$LEDR36_IC3_PIN23  (1 unrouted)
N$LEDR37_IC3_PIN8  (1 unrouted)
N$LEDR38_IC3_PIN14  (1 unrouted)
N$LEDR39_IC3_PIN20  (1 unrouted)
N$LEDR40_IC3_PIN26  (1 unrouted)
SCLK1  (1 unrouted)
  Bottom 0.127: SV1.7 8.31,0.8 4.64,0.8 3.4,2.04 3.4,7.6 2.5,8.5 2.5,105.6 10.5,113.6 17.8,113.6 18.2,113.2 18.8,113.2 19.07,113.47 IC1.2
SCLK2  (1 unrouted)
  Bottom 0.127: SV2.7 25.24,0.8 21,0.8 20.3,1.5 20.3,5.2 19.4,6.1 18.5,6.1 12.2,12.4 12.2,57.7 16.9,62.4 17.7,62.4 18.1,62 18.59,62 19.07,62.48 IC2.2
SCLK3  (1 unrouted)
  Bottom 0.127: SV3.7 41.87,0.5 38,0.5 37.2,1.3 37.2,5.3 33.2,9.3 18.3,9.3 15.4,12.2 15.4,22.3 17.5,24.4 17.6,24.4 18.1,23.9 18.62,23.9 19.07,24.34 IC3.2
SIN1  (1 unrouted)
  Bottom 0.127: SV1.2 2.12,105.92 10.5,114.3 18.55,114.3 IC1.1
SIN2  (2 unrouted)
  Bottom 0.127: 11.8,12.02 11.8,58 17,63.2 18.53,63.2 IC2.1
SIN3  (2 unrouted)
  Bottom 0.127: 35.98,5.67 32.75,8.9 17.9,8.9 14.9,11.9 14.9,22.8 17.3,25.2 18.47,25.2 IC3.1
SOUT1  (2 unrouted)
SOUT2  (2 unrouted)
SOUT3  (2 unrouted)